# Altium schematic sheet Alimentacion.SchDoc
size A4
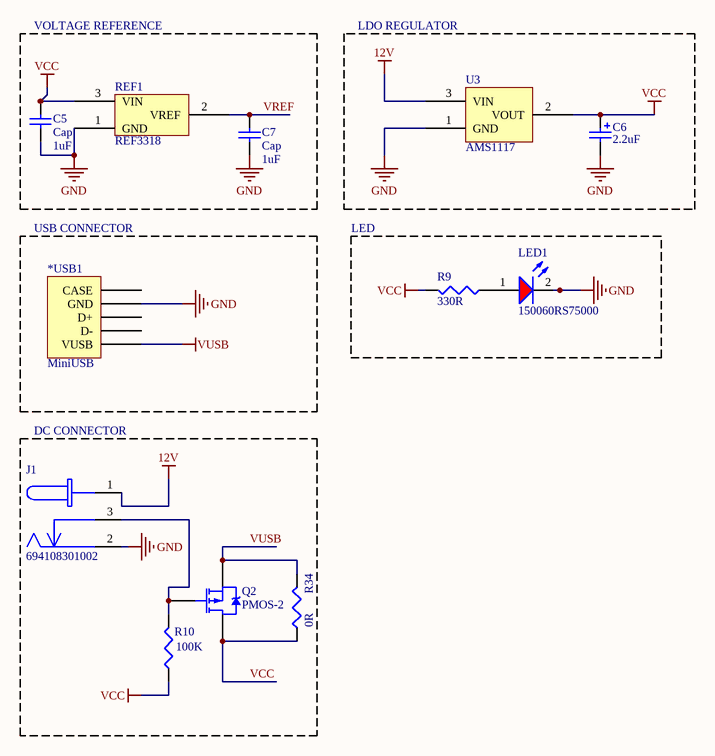
[diagram p0: Alimentacion.SchDoc]

## Parts
*USB1  MiniUSB  [Mini USB]
C5  Cap  value 1uF  [C0805]
C6  value 2.2uF  [C0805]  (hidden comment: CapPol)
C7  Cap  value 1uF  [C0805]
J1  694108301002  [694108301002]
LED1  150060RS75000  [LED_0603_Red]
Q2  PMOS-2  [SOT23_N]
R9  value 330R  [6-0805_N]  (hidden comment: Res)
R10  value 100K  [6-0805_N]  (hidden comment: Res)
R34  value 0R  [6-0805_N]  (hidden comment: Res)
REF1  REF3318  [SOT23_N]
U3  AMS1117  [SOT223_N]

## Blocks framed on the sheet
VOLTAGE REFERENCE: C5 C7 REF1
LDO REGULATOR: C6 U3
USB CONNECTOR: *USB1
LED: LED1 R9
DC CONNECTOR: J1 Q2 R10 R34

## Nets
12V: J1.1 U3.3(VIN)
GND: *USB1.2(GND) C5.1 C6.2 C7.1 J1.2 LED1.2(C) REF1.1(GND) U3.1(GND)
VCC: C5.2 C6.1 Q2.1(D) R9.2 R10.1 R34.1 REF1.3(VIN) U3.2(VOUT)
VUSB: *USB1.6(VUSB) Q2.2(S) R34.2
VREF: C7.2 REF1.2(VREF)
NetJ1_3: J1.3 Q2.3(G) R10.2
NetLED1_1: LED1.1(A) R9.1

Not connected (* = marked no-connect by the designer): *USB1 1(CASE) 4(D+) 5(D-)

## Library data of the parts
*USB1 = MiniUSB: KYOCERA  24 5141 005 000 863
C5 C7 = Cap: Capacitor; Published: 8-Jun-2000; LatestRevisionDate: 17-Jul-2002; LatestRevisionNote: Re-released for DXP Platform.; PackageReference: RAD-0.3; Publisher: Altium Limited; PackageDescription: Radial Cap, Thru-Hole; 2 Leads; 0.3 in Pin Spacing
J1 = 694108301002: WR-DC DC Power Jack Right Angled(6.4); Published: June 2016; Publisher: Wurth Elektronik; ComponentLink1Description: Manufacturer; ComponentLink1URL: http://www.we-online.de; ComponentLink2Description: Datasheet; ComponentLink2URL: http://katalog.we-online.de/em/datasheet/6941xx301002.pdf; PartNumber: 694108301002
LED1 = WL-SMCW 0603  150060RS75000: SMD mono-color Chip LED, WL-SMCW, Red; Manufacturer: W黵th Elektronik eiSos GmbH; PartNo: 150060RS75000; ComponentLink1Description: Manufacturer; ComponentLink1URL: http://www.we-online.de; Created by: Christin Otto; Created Date: June 2013; ComponentLink2Description: Datasheet; ComponentLink2URL: http://katalog.we-online.com/led/datasheet/150060RS75000.pdf; Color: Red
Q2 = PMOS-2: P-Channel Power MOSFET; Note: Pin 4 not drawn and electrically connected to Pin 2.; Published: 8-Jun-2000; LatestRevisionDate: 17-Jul-2002; LatestRevisionNote: Re-released for DXP Platform.; DatasheetVersion: PD-9.390D; PackageVersion: Feb-1997; PackageReference: TO-220AB; Publisher: Altium Limited; PackageDescription: TO, Thru-Hole, Vertical, Heatsink Mounted; 3 In-Line Leads; Pitch 2.54 mm; ComponentLink1Description: Manufacturer Link; ComponentLink1URL: http://www.irf.com/
R9 R10 R34 = Res3: Resistor; Published: 8-Jun-2000; LatestRevisionDate: 29-May-2009; LatestRevisionNote: IPC-7351 Footprint Added.; PackageReference: J1-0603; Publisher: Altium Limited; PackageDescription: Chip Resistor